# EAGLE design pnc3000-interface (EAGLE 7.6.0)
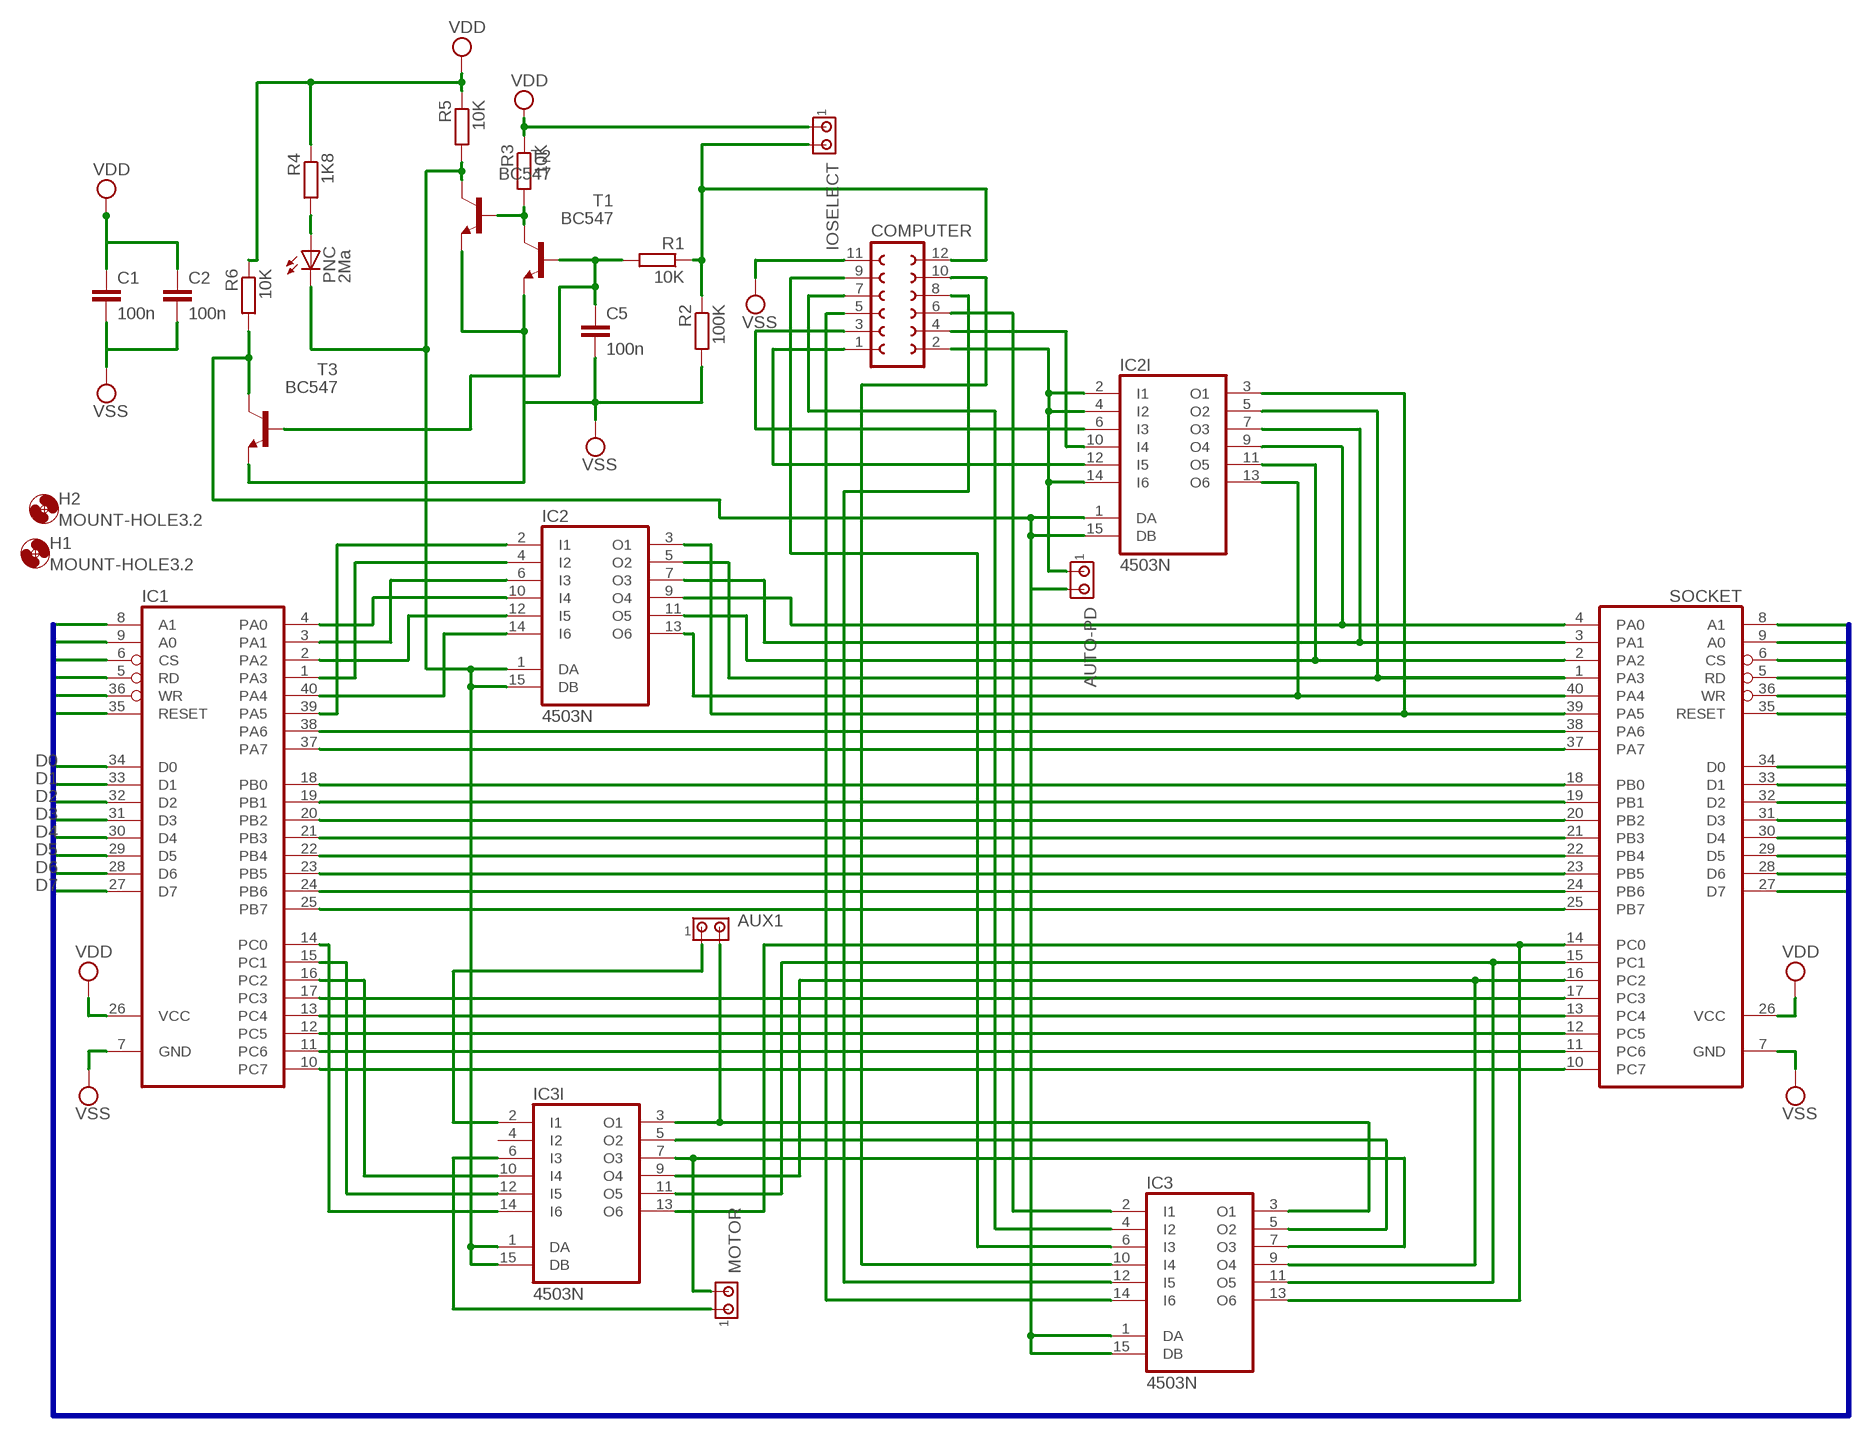
[diagram p0: schematic, sheet 1]

## Parts
AUTO-PD  MTA02-100  [10X02MTA]
AUX1  MTA02-100  [10X02MTA]
C1  100n  C-EU050-024X044  [C050-024X044]
C2  100n  C-EU050-024X044  [C050-024X044]
C5  100n  C-EU050-024X044  [C050-024X044]
COMPUTER  FE06-2W  [FE06-2W]
H1  MOUNT-HOLE3.2  [3,2]
H2  MOUNT-HOLE3.2  [3,2]
IC1  82C55A  [DIL40]
IC2  4503N  [DIL16]
IC2I  4503N  [DIL16]
IC3  4503N  [DIL16]
IC3I  4503N  [DIL16]
IOSELECT  MTA02-100  [10X02MTA]
MOTOR  MTA02-100  [10X02MTA]
PNC  2Ma  LED5MM  [LED5MM]
R1  10K  R-EU_0207/10  [0207/10]
R2  100K  R-EU_0207/10  [0207/10]
R3  10K  R-EU_0207/10  [0207/10]
R4  1K8  R-EU_0207/10  [0207/10]
R5  10K  R-EU_0207/10  [0207/10]
R6  10K  R-EU_0207/10  [0207/10]
SOCKET  82C55A  [DIL40]
T1  BC547  [TO92]
T2  BC547  [TO92]
T3  BC547  [TO92]

## Nets
A0: IC1.9(A0) SOCKET.9(A0)
A1: IC1.8(A1) SOCKET.8(A1)
CS: IC1.6(CS) SOCKET.6(CS)
D0: IC1.34(D0) SOCKET.34(D0)
D1: IC1.33(D1) SOCKET.33(D1)
D2: IC1.32(D2) SOCKET.32(D2)
D3: IC1.31(D3) SOCKET.31(D3)
D4: IC1.30(D4) SOCKET.30(D4)
D5: IC1.29(D5) SOCKET.29(D5)
D6: IC1.28(D6) SOCKET.28(D6)
D7: IC1.27(D7) SOCKET.27(D7)
EXT-ENABLE: AUTO-PD.2 IC2I.1(DA) IC2I.15(DB) IC3.1(DA) IC3.15(DB) R6.2 T3.3(C)
MOTOR: IC3I.6(I3) MOTOR.1
N$1: IC1.18(PB0) SOCKET.18(PB0)
N$2: IC1.19(PB1) SOCKET.19(PB1)
N$3: IC1.20(PB2) SOCKET.20(PB2)
N$4: IC1.21(PB3) SOCKET.21(PB3)
N$5: IC1.22(PB4) SOCKET.22(PB4)
N$6: IC1.23(PB5) SOCKET.23(PB5)
N$7: IC1.24(PB6) SOCKET.24(PB6)
N$8: IC1.25(PB7) SOCKET.25(PB7)
N$9: IC1.11(PC6) SOCKET.11(PC6)
N$10: IC1.10(PC7) SOCKET.10(PC7)
N$11: IC1.37(PA7) SOCKET.37(PA7)
N$12: IC1.17(PC3) SOCKET.17(PC3)
N$13: IC1.13(PC4) SOCKET.13(PC4)
N$14: IC1.12(PC5) SOCKET.12(PC5)
N$15: IC1.38(PA6) SOCKET.38(PA6)
N$16: IC1.4(PA0) IC2.10(I4)
N$17: IC2.9(O4) IC2I.9(O4) SOCKET.4(PA0)
N$18: IC1.3(PA1) IC2.6(I3)
N$19: IC2.7(O3) IC2I.7(O3) SOCKET.3(PA1)
N$20: IC1.2(PA2) IC2.12(I5)
N$21: IC2.11(O5) IC2I.11(O5) SOCKET.2(PA2)
N$22: IC1.1(PA3) IC2.4(I2)
N$23: IC2.5(O2) IC2I.5(O2) SOCKET.1(PA3)
N$24: IC1.39(PA5) IC2.2(I1)
N$25: IC2.3(O1) IC2I.3(O1) SOCKET.39(PA5)
N$26: IC1.40(PA4) IC2.14(I6)
N$27: IC2.13(O6) IC2I.13(O6) SOCKET.40(PA4)
N$28: IC1.16(PC2) IC3I.10(I4)
N$29: IC3.9(O4) IC3I.9(O4) SOCKET.16(PC2)
N$30: IC1.15(PC1) IC3I.12(I5)
N$31: IC3.11(O5) IC3I.11(O5) SOCKET.15(PC1)
N$32: IC1.14(PC0) IC3I.14(I6)
N$33: IC3.13(O6) IC3I.13(O6) SOCKET.14(PC0)
N$34: COMPUTER.6 IC3.2(I1)
N$35: COMPUTER.5 IC3.14(I6)
N$36: COMPUTER.7 IC3.4(I2)
N$37: COMPUTER.1 IC2I.12(I5)
N$38: COMPUTER.3 IC2I.6(I3)
N$39: COMPUTER.4 IC2I.10(I4)
N$40: AUTO-PD.1 COMPUTER.2 IC2I.2(I1) IC2I.4(I2) IC2I.14(I6)
N$41: COMPUTER.8 IC3.12(I5)
N$42: COMPUTER.9 IC3.6(I3)
N$43: COMPUTER.10 IC3.10(I4)
N$44: IC3.7(O3) IC3I.7(O3) MOTOR.2
N$45: IC3.5(O2) IC3I.5(O2)
N$46: AUX1.2 IC3.3(O1) IC3I.3(O1)
N$47: PNC.A R4.2
N$48: COMPUTER.12 IOSELECT.2 R1.1 R2.1
N$49: C5.1 R1.2 T1.2(B) T3.2(B)
N$51: AUX1.1 IC3I.2(I1)
N$55: R3.2 T1.3(C) T2.2(B)
PNC-ENABLE: IC2.1(DA) IC2.15(DB) IC3I.1(DA) IC3I.15(DB) PNC.K(C) R5.2 T2.3(C)
RD: IC1.5(RD) SOCKET.5(RD)
RESET: IC1.35(RESET) SOCKET.35(RESET)
VDD: C1.1 C2.1 IC1.26(VCC) IOSELECT.1 R3.1 R4.1 R5.1 R6.1 SOCKET.26(VCC)
VSS: C1.2 C2.2 C5.2 COMPUTER.11 IC1.7(GND) R2.2 SOCKET.7(GND) T1.1(E) T2.1(E) T3.1(E)
WR: IC1.36(WR) SOCKET.36(WR)
Unconnected: IC3I.4(I2)

## Buses
B$1

## Power pins joined to a net without a drawn wire
VDD: IC2.16(VDD) IC2I.16(VDD) IC3.16(VDD) IC3I.16(VDD)
VSS: IC2.8(VSS) IC2I.8(VSS) IC3.8(VSS) IC3I.8(VSS)

## Library data of the parts
AUTO-PD AUX1 IOSELECT MOTOR = con-amp:MTA02-100: AMP connector
C1 C2 C5 = rcl:C-EU: CAPACITOR, European symbol
COMPUTER = con-lsta:FE06-2W: FEMALE HEADER; OC_FARNELL: unknown; OC_NEWARK: unknown
H1 H2 = holes:MOUNT-HOLE: MOUNTING HOLE with drill center marker
IC1 SOCKET = micro-intel:82C55A: MICROCOMPUTER/PERIPHERAL DEVICE; MF: INTERSIL; MPN: IP82C55AZ; OC_FARNELL: 1562050; OC_NEWARK: 79K6939
IC2 IC2I IC3 IC3I = 45xx:4503: Tri-state hex BUFFER, 74C367, 80C97
PNC = led:LED: LED OSRAM: - CHIPLED LG R971, LG N971, LY N971, LG Q971, LY Q971, LO R971, LY R971 LH N974, LH R974 LS Q976, LO Q976, LY Q976 LO Q996 - Hyper CHIPLED LW Q18S LB Q993, LB Q99A, LB R99A - SideLED LS A670, LO A670, LY A670, LG A670, LP A670 LB A673, LV A673, LT A673, LW A673 LH A674 LY A675 LS A676, LA A676, LO A676, LY A676, LW A676 LS A679, LY A679, LG A679 - Hyper Micro SIDELED® LS Y876, LA Y876, LO Y876, LY Y876 LT Y87S - SmartLED LW L88C, LW L88S LB L89C, LB L89S, LG L890 LS L89K, LO L89K, LY L89K LS L896, LA L896, LO L896, LY L896 - TOPLED LS T670, LO T670, LY T670, LG T670, LP T670 LSG T670, LSP T670, LSY T670, LOP T670, LYG T670 LG T671, LOG T671, LSG T671 LB T673, LV T673, LT T673, LW T673 LH T674 LS T676, LA T676, LO T676, LY T676, LB T676, LH T676, LSB T676, LW T676 LB T67C, LV T67C, LT T67C, LS T67K, LO T67K, LY T67K, LW E67C LS E67B, LA E67B, LO E67B, LY E67B, LB E67C, LV E67C, LT E67C LW T67C LS T679, LY T679, LG T679 LS T770, LO T770, LY T770, LG T770, LP T770 LB T773, LV T773, LT T773, LW T773 LH T774 LS E675, LA E675, LY E675, LS T675 LS T776, LA T776, LO T776, LY T776, LB T776 LHGB T686 LT T68C, LB T68C - Hyper Mini TOPLED® LB M676 - Mini TOPLED Santana® LG M470 LS M47K, LO M47K, LY M47K Source: http://www.osram.convergy.de LUXEON: - LUMILED® LXK2-PW12-R00, LXK2-PW12-S00, LXK2-PW14-U00, LXK2-PW14-V00 LXK2-PM12-R00, LXK2-PM12-S00, LXK2-PM14-U00 LXK2-PE12-Q00, LXK2-PE12-R00, LXK2-PE12-S00, LXK2-PE14-T00, LXK2-PE14-U00 LXK2-PB12-K00, LXK2-PB12-L00, LXK2-PB12-M00, LXK2-PB14-N00, LXK2-PB14-P00, LXK2-PB14-Q00 LXK2-PR12-L00, LXK2-PR12-M00, LXK2-PR14-Q00, LXK2-PR14-R00 LXK2-PD12-Q00, LXK2-PD12-R00, LXK2-PD12-S00 LXK2-PH12-R00, LXK2-PH12-S00 LXK2-PL12-P00, LXK2-PL12-Q00, LXK2-PL12-R00 Source: www.luxeon.com KINGBRIGHT: KA-3528ASYC Source: www.kingbright.com
R1-R6 = rcl:R-EU_: RESISTOR, European symbol
T1-T3 = transistor:BC547: NPN TRANSISTOR

## Board
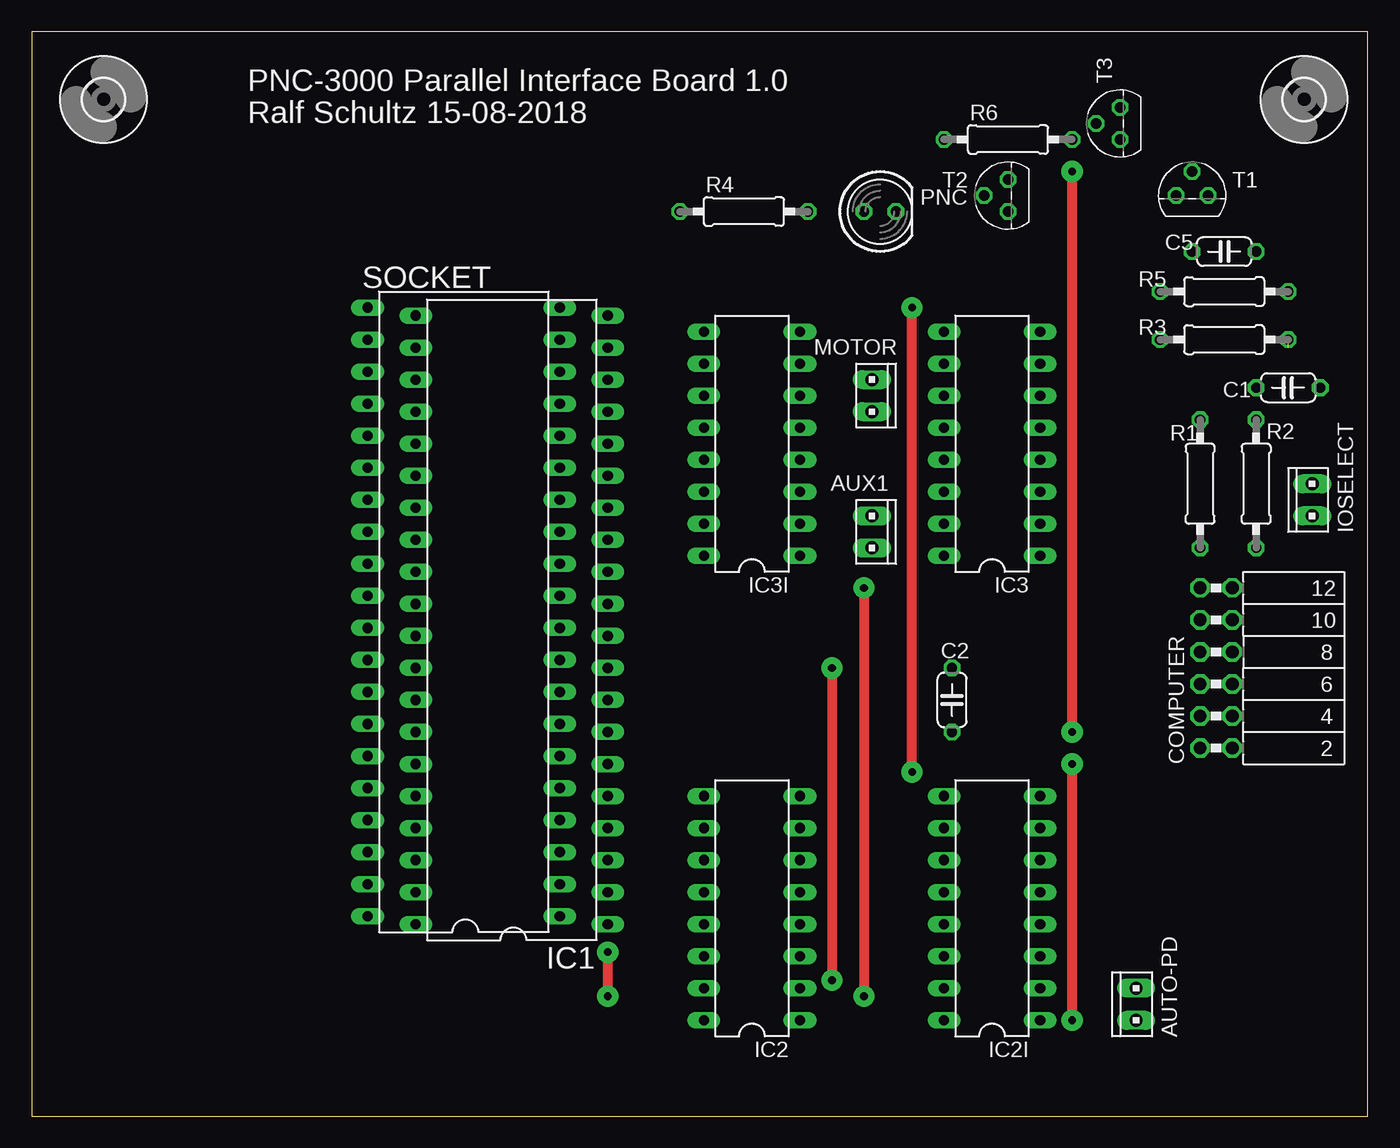
[diagram p1: board, top side]
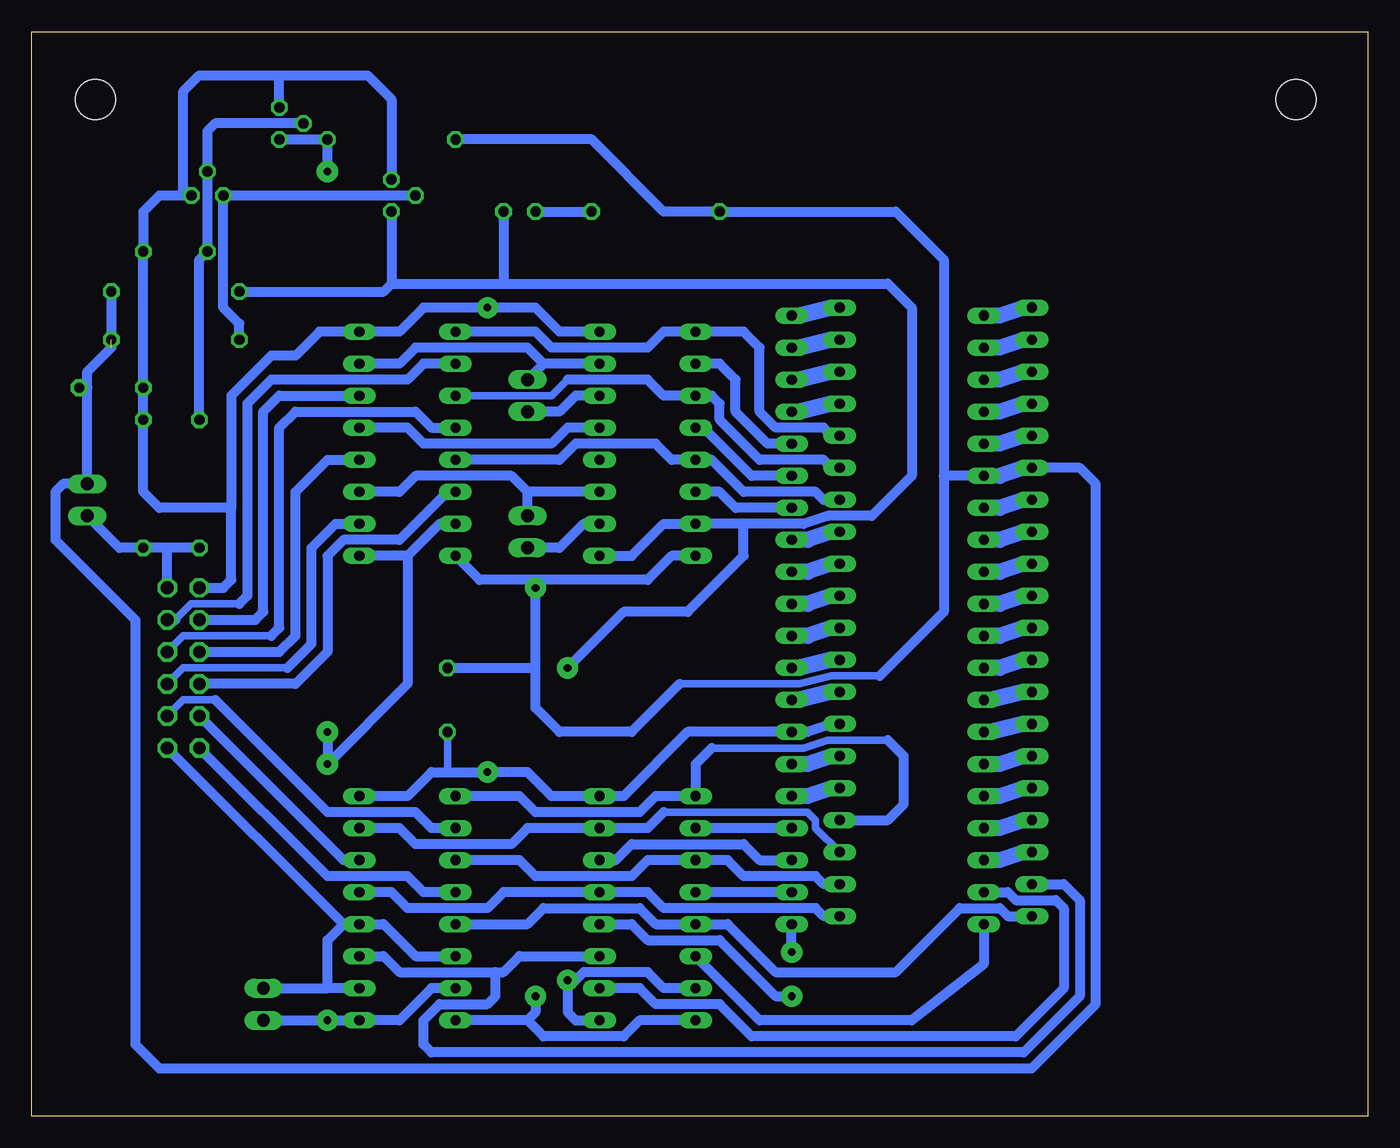
[diagram p2: board, bottom side, seen from below]

Size 106.03 x 86.03 mm. Coordinates in mm from the lower left corner, seen from the top.
Outline: 0,0 106.03,0 106.03,86.03 0,86.03 0,0
Copper layers (1*16): Top 0.035mm / dielectric 1.5mm / Bottom 0.035mm
Design rules "default": minimum track width 10mil, minimum drill 0.6mm, track to track 8mil, track to pad 8mil, pad to pad 8mil, via to via 8mil, smd to smd 8mil, copper to edge 40mil, drill to drill 8mil, minimum pad ring 10mil, minimum via ring 8mil, stop-mask expansion 4mil, vias tented up to drill 0mil, thermal gap 10mil

### Footprints (pad centres in the part's own frame; a part is rotated, then mirrored left to right if it is on the bottom)
10X02MTA = drill 1.016 long: 1 1.27,0; 2 -1.27,0
C050-024X044 = drill 0.813 octagon: 1 -2.54,0; 2 2.54,0
FE06-2W = drill 1.016 octagon: 1 -6.35,1.27; 2 -6.35,-1.27; 3 -3.81,1.27; 4 -3.81,-1.27; 5 -1.27,1.27; 6 -1.27,-1.27; 7 1.27,1.27; 8 1.27,-1.27; 9 3.81,1.27; 10 3.81,-1.27; 11 6.35,1.27; 12 6.35,-1.27
3,2 = hole 3.2: 0,0
DIL40 = drill 0.813 long: 1 -24.13,-7.62; 2 -21.59,-7.62; 3 -19.05,-7.62; 4 -16.51,-7.62; 5 -13.97,-7.62; 6 -11.43,-7.62; 7 -8.89,-7.62; 8 -6.35,-7.62; 9 -3.81,-7.62; 10 -1.27,-7.62; 11 1.27,-7.62; 12 3.81,-7.62; 13 6.35,-7.62; 14 8.89,-7.62; 15 11.43,-7.62; 16 13.97,-7.62; 17 16.51,-7.62; 18 19.05,-7.62; 19 21.59,-7.62; 20 24.13,-7.62; 21 24.13,7.62; 22 21.59,7.62; 23 19.05,7.62; 24 16.51,7.62; 25 13.97,7.62; 26 11.43,7.62; 27 8.89,7.62; 28 6.35,7.62; 29 3.81,7.62; 30 1.27,7.62; 31 -1.27,7.62; 32 -3.81,7.62; 33 -6.35,7.62; 34 -8.89,7.62; 35 -11.43,7.62; 36 -13.97,7.62; 37 -16.51,7.62; 38 -19.05,7.62; 39 -21.59,7.62; 40 -24.13,7.62
DIL16 = drill 0.813 long: 1 -8.89,-3.81; 2 -6.35,-3.81; 3 -3.81,-3.81; 4 -1.27,-3.81; 5 1.27,-3.81; 6 3.81,-3.81; 7 6.35,-3.81; 8 8.89,-3.81; 9 8.89,3.81; 10 6.35,3.81; 11 3.81,3.81; 12 1.27,3.81; 13 -1.27,3.81; 14 -3.81,3.81; 15 -6.35,3.81; 16 -8.89,3.81
LED5MM = drill 0.813 octagon: A -1.27,0; K 1.27,0
0207/10 = drill 0.813 octagon: 1 -5.08,0; 2 5.08,0
TO92 = drill 0.813 octagon: 1 1.27,0; 2 0,1.905; 3 -1.27,0

### Placement (x,y rotation side)
AUTO-PD  87.63,8.89 90 top
AUX1  66.67,46.35 270 top
C1  99.69,57.78 180 top
C2  73.03,33.02 270 top
C5  94.61,68.58 0 top
COMPUTER  93.98,35.56 90 top
H1  100.97,80.64 0 top
H2  5.71,80.64 0 top
IC1  38.1,39.37 90 top
IC2  57.15,16.51 90 top
IC2I  76.2,16.51 90 top
IC3  76.2,53.34 90 top
IC3I  57.15,53.34 90 top
IOSELECT  101.6,48.9 90 top
MOTOR  66.67,57.15 270 top
PNC  67.31,71.75 0 top
R1  92.71,50.16 90 top
R2  97.16,50.16 90 top
R3  94.61,61.59 180 top
R4  56.52,71.75 0 top
R5  94.61,65.41 180 top
R6  77.47,77.47 0 top
SOCKET  34.29,40.01 90 top
T1  92.08,73.03 0 top
T2  77.47,73.03 90 top
T3  86.36,78.74 90 top

### Tracks (layer width: path | path; a pad name or v marks a point on that pad's centre or on a via)
A0
  Bottom 1.27: SOCKET.9 42.55,36.2 45.09,35.56 IC1.9
A1
  Bottom 1.27: SOCKET.8 42.55,33.66 45.09,33.02 IC1.8
CS
  Bottom 1.27: SOCKET.6 42.55,28.57 44.45,27.94 IC1.6
D0
  Bottom 1.27: SOCKET.34 27.3,31.11 29.84,30.48 IC1.34
D1
  Bottom 1.27: SOCKET.33 27.3,33.66 29.84,33.02 IC1.33
D2
  Bottom 1.27: SOCKET.32 27.3,36.2 29.21,35.56 IC1.32
D3
  Bottom 1.27: SOCKET.31 27.3,38.73 29.21,38.1 IC1.31
D4
  Bottom 1.27: SOCKET.30 27.3,41.27 29.21,40.64 IC1.30
D5
  Bottom 1.27: SOCKET.29 27.3,43.81 29.21,43.18 IC1.29
D6
  Bottom 1.27: SOCKET.28 27.3,46.35 29.21,45.72 IC1.28
D7
  Bottom 1.27: SOCKET.27 27.3,48.9 29.21,48.26 IC1.27
EXT-ENABLE  (via drill 0.6, 0.6 pad 1.68)
  Top 0.813: v82.55,27.94 v82.55,7.62 | v82.55,74.93 v82.55,30.48
  Bottom 0.813: IC2I.15 74.3,10.16 76.83,7.62 IC2I.1 v82.55,7.62 AUTO-PD.2 | IC3.15 73.66,46.99 76.2,44.45 | 76.2,44.45 IC3.1 | 76.2,44.45 76.2,34.29 v82.55,27.94 v82.55,30.48 | v82.55,74.93 R6.2 T3.3
MOTOR
  Bottom 0.813: IC3I.6 62.87,57.15 64.14,55.88 MOTOR.1
N$1
  Bottom 1.27: SOCKET.18 42.55,59.05 45.09,58.42 IC1.18
N$2
  Bottom 1.27: SOCKET.19 42.55,61.59 45.09,60.96 IC1.19
N$3
  Bottom 1.27: SOCKET.20 42.55,64.14 45.09,63.5 IC1.20
N$4
  Bottom 1.27: SOCKET.21 27.3,64.14 29.21,63.5 IC1.21
N$5
  Bottom 1.27: SOCKET.22 27.3,61.59 29.21,60.96 IC1.22
N$6
  Bottom 1.27: SOCKET.23 27.3,59.05 29.21,58.42 IC1.23
N$7
  Bottom 1.27: SOCKET.24 27.3,56.52 29.21,55.88 IC1.24
N$8
  Bottom 1.27: SOCKET.25 27.3,53.98 29.21,53.34 IC1.25
N$9
  Bottom 1.27: SOCKET.11 42.55,41.27 44.45,40.64 IC1.11
N$10
  Bottom 1.27: SOCKET.10 42.55,38.73 44.45,38.1 IC1.10
N$11
  Bottom 1.27: SOCKET.37 27.3,23.5 29.21,22.86 IC1.37
N$12
  Bottom 1.27: SOCKET.17 42.55,56.52 45.09,55.88 IC1.17
N$13
  Bottom 1.27: SOCKET.13 42.55,46.35 44.45,45.72 IC1.13
N$14
  Bottom 1.27: SOCKET.12 42.55,43.81 44.45,43.18 IC1.12
N$15
  Bottom 1.27: SOCKET.38 27.3,20.95 29.21,20.32 IC1.38
N$16
  Bottom 0.813: IC1.4 IC2.10
N$17
  Bottom 0.61: 38.1,29.84 42.86,29.84 44.77,29.21 52.07,29.21
  Bottom 0.813: IC2I.9 67.31,25.4 66.04,24.13 57.78,24.13 56.52,25.4 IC2.9 53.34,27.94 52.07,29.21 | SOCKET.4 38.1,23.5 36.83,24.77 36.83,28.57 38.1,29.84
N$18
  Bottom 0.813: IC2.6 59.69,20.32 58.42,21.59 49.53,21.59 48.26,20.32 IC1.3
N$19
  Bottom 0.61: SOCKET.3 43.81,22.86 43.81,23.5 44.45,24.13 55.88,24.13
  Bottom 0.813: IC2I.7 76.83,22.86 75.56,21.59 67.94,21.59 66.67,22.86 IC2.7 57.15,22.86 55.88,24.13
N$20
  Bottom 0.813: IC1.2 IC2.12
N$21
  Bottom 0.813: SOCKET.2 43.18,18.41 43.81,19.05 49.53,19.05 50.8,20.32 IC2.11 57.15,20.32 58.42,19.05 66.04,19.05 67.31,20.32 IC2I.11
N$22  (via drill 0.6, 0.6 pad 1.68)
  Top 0.813: v45.72,9.53 v45.72,13.02
  Bottom 0.813: IC2.4 58.42,15.24 57.15,13.97 51.44,13.97 46.99,9.53 v45.72,9.53 | v45.72,13.02 IC1.1
N$23
  Bottom 0.813: SOCKET.1 43.18,15.88 43.81,16.51 55.88,16.51 57.15,17.78 IC2.5 68.58,17.78 69.85,16.51 76.2,16.51 77.47,17.78 IC2I.5
N$24
  Bottom 0.813: IC1.39 28.57,17.78 27.94,17.14 24.77,17.14 24.13,16.51 24.13,10.16 27.94,6.35 48.9,6.35 51.44,8.89 56.52,8.89 57.78,10.16 IC2.2
N$25
  Bottom 0.813: IC2I.3 78.11,12.7 76.83,11.43 69.22,11.43 | 69.22,11.43 68.58,11.43 67.31,12.7 IC2.3 | SOCKET.39 24.13,18.41 22.86,17.14 22.86,9.53 27.3,5.08 74.3,5.08 74.93,5.71 74.93,7.62 73.66,8.89 69.85,8.89 69.22,9.53 69.22,11.43
N$26
  Bottom 0.813: IC1.40 30.48,12.06 36.2,7.62 48.26,7.62 IC2.14
N$27
  Bottom 0.813: IC2I.13 66.67,15.24 65.41,16.51 57.78,16.51 56.52,15.24 IC2.13 50.8,15.24 46.99,11.43 37.47,11.43 32.38,16.51 29.21,16.51 28.57,15.88 SOCKET.40
N$28
  Bottom 0.813: IC1.16 47.62,53.34 50.16,55.88 50.16,58.42 51.44,59.69 IC3I.10
N$29
  Bottom 0.813: SOCKET.16 42.55,53.98 43.18,54.61 46.99,54.61 48.26,55.88 48.26,60.96 49.53,62.23 IC3I.9 55.88,62.23 57.15,60.96 64.77,60.96 66.04,62.23 IC3.9
N$30
  Bottom 0.813: IC1.15 48.9,50.8 52.7,54.61 IC3I.12
N$31
  Bottom 0.61: 63.5,58.42 64.77,57.15 IC3.11
  Bottom 0.813: SOCKET.15 42.55,51.44 43.18,52.07 48.26,52.07 51.44,55.24 51.44,56.52 52.07,57.15 IC3I.11 55.88,57.15 57.15,58.42 63.5,58.42
N$32
  Bottom 0.813: IC1.14 50.16,48.26 51.44,49.53 IC3I.14
N$33
  Bottom 0.813: SOCKET.14 43.18,48.9 43.81,49.53 49.53,49.53 52.07,52.07 IC3I.13 55.24,52.07 56.52,53.34 62.87,53.34 64.14,52.07 IC3.13
N$34
  Bottom 0.61: COMPUTER.6 93.98,35.56 85.72,35.56
  Bottom 0.813: 85.72,35.56 83.82,37.47 83.82,45.09 81.92,46.99 IC3.2
N$35
  Bottom 0.813: IC3.14 73.03,49.53 76.83,45.72 81.28,45.72 82.55,44.45 82.55,36.83 85.09,34.29 COMPUTER.5
N$36
  Bottom 0.813: COMPUTER.7 86.36,36.83 85.09,38.1 85.09,49.53 82.55,52.07 IC3.4
N$37
  Bottom 0.813: IC2I.12 74.93,17.78 76.2,19.05 82.55,19.05 COMPUTER.1
N$38
  Bottom 0.813: IC2I.6 81.28,20.32 COMPUTER.3
N$39
  Bottom 0.61: 91.44,33.02 93.98,33.02 COMPUTER.4
  Bottom 0.813: IC2I.10 74.3,22.86 75.56,24.13 82.55,24.13 91.44,33.02
N$40
  Bottom 0.813: 81.28,15.24 IC2I.4 78.11,15.24 75.56,12.7 IC2I.14 | 81.28,15.24 COMPUTER.2 | IC2I.2 82.55,10.16 | 82.55,10.16 82.55,13.97 81.28,15.24 | AUTO-PD.1 82.55,10.16
N$41
  Bottom 0.61: COMPUTER.8 93.98,38.1 87,38.1
  Bottom 0.813: 87,38.1 86.36,38.73 86.36,54.61 85.09,55.88 75.56,55.88 74.3,54.61 IC3.12
N$42
  Bottom 0.813: COMPUTER.9 88.27,39.37 87.63,40.01 87.63,55.88 86.36,57.15 IC3.6
N$43
  Bottom 0.61: 89.53,40.64 93.34,40.64 94.61,39.37
  Bottom 0.813: IC3.10 74.93,59.69 76.2,58.42 87,58.42 88.9,56.52 88.9,41.27 89.53,40.64 | 94.61,39.37 COMPUTER.10
N$44
  Bottom 0.813: IC3I.7 65.41,59.69 | 65.41,59.69 66.67,60.96 75.56,60.96 76.83,59.69 IC3.7 | MOTOR.2 65.41,59.69
N$45
  Bottom 0.813: IC3I.5 63.5,54.61 64.77,53.34 74.93,53.34 76.2,54.61 IC3.5
N$46
  Bottom 0.813: IC3I.3 66.67,49.53 | 66.67,49.53 67.94,50.8 75.56,50.8 76.83,49.53 IC3.3 | AUX1.2 66.67,49.53
N$47
  Bottom 0.813: PNC.A R4.2
N$48
  Bottom 0.813: R1.1 95.25,45.09 | 95.25,45.09 R2.1 99.06,45.09 IOSELECT.2 | COMPUTER.12 95.25,45.09
N$49
  Bottom 0.813: R1.2 92.71,67.94 C5.1 T1.2 92.08,78.11 91.44,78.74 T3.2
N$51
  Bottom 0.813: IC3I.2 62.23,46.99 64.14,45.09 AUX1.1
N$55
  Bottom 0.813: R3.2 89.53,62.87 90.81,64.14 T1.3 T2.2
PNC-ENABLE  (via drill 0.6, 0.6 pad 1.68)
  Top 0.813: v63.5,35.56 v63.5,10.79
  Bottom 0.813: IC2.15 55.88,10.16 57.15,11.43 62.23,11.43 63.5,10.16 | 63.5,10.16 63.5,8.26 62.87,7.62 IC2.1 | T2.3 77.47,66.04 | R5.2 78.11,65.41 77.47,66.04 | 77.47,66.04 68.58,66.04 | 68.58,66.04 38.1,66.04 36.2,64.14 36.2,50.8 39.37,47.62 42.86,47.62 44.77,46.99 49.53,46.99 | IC3I.1 58.42,44.45 55.88,46.99 IC3I.15 49.53,46.99 | v63.5,35.56 59.05,40.01 53.98,40.01 49.53,44.45 49.53,46.99 | v63.5,10.79 63.5,10.16 | PNC.K 68.58,66.04
RD
  Bottom 1.27: SOCKET.5 42.55,26.04 44.45,25.4 IC1.5
RESET
  Bottom 1.27: SOCKET.35 27.3,28.57 29.21,27.94 IC1.35
VDD  (via drill 0.6, 0.6 pad 1.68)  (1 unrouted)
  Top 0.813: v66.04,41.91 v66.04,9.53
  Bottom 0.61: 38.73,34.92 42.55,34.92 45.09,34.29 54.61,34.29
  Bottom 0.813: IC3I.16 55.24,44.45 57.15,42.55 66.04,42.55 | 66.04,42.55 70.48,42.55 IC3.16 | IC2.16 57.78,7.62 59.05,6.35 65.41,6.35 66.67,7.62 | 66.67,7.62 IC2I.16 | 66.04,42.55 v66.04,41.91 66.04,35.56 | v66.04,9.53 66.04,8.26 66.67,7.62 | SOCKET.26 22.86,51.44 21.59,50.16 21.59,8.89 26.67,3.81 95.89,3.81 97.79,5.71 97.79,39.37 104.14,45.72 104.14,49.53 103.5,50.16 IOSELECT.1 101.6,57.78 | R5.1 R3.1 | 101.6,57.78 101.6,59.05 99.69,60.96 | C1.1 101.6,57.78 | 33.66,50.8 IC1.26 29.21,50.8 | 33.66,50.8 33.66,40.01 38.73,34.92 | 54.61,34.29 58.42,30.48 64.14,30.48 66.04,32.38 66.04,35.56 | C2.1 66.04,35.56 | 33.66,50.8 33.66,67.94 37.47,71.75 R4.1 55.88,71.75 61.59,77.47 R6.1
  Bottom 1.27: SOCKET.26 27.3,51.44 29.21,50.8
VSS  (via drill 0.6, 0.6 pad 1.68)
  Top 0.813: v69.85,27.3 v69.85,64.14
  Bottom 0.61: C2.2 73.03,27.3
  Bottom 0.813: IC3I.8 64.14,62.23 66.04,64.14 v69.85,64.14 74.93,64.14 76.83,62.23 IC3.8 83.19,62.23 85.09,60.33 87,60.33 90.17,57.15 90.17,48.26 | IC2I.8 76.2,25.4 74.3,27.3 73.03,27.3 v69.85,27.3 66.67,27.3 64.77,25.4 IC2.8 59.05,25.4 53.98,30.48 IC1.7 44.45,30.48 42.55,31.11 | 93.98,73.03 95.89,73.03 97.16,71.75 C5.2 C1.2 R2.2 97.16,49.53 95.89,48.26 90.17,48.26 | T1.1 93.98,73.03 | 93.98,73.03 93.98,81.28 92.71,82.55 86.36,82.55 | 86.36,82.55 79.38,82.55 77.47,80.64 T2.1 | COMPUTER.11 90.81,41.91 90.17,42.55 90.17,48.26 | T3.1 86.36,82.55
  Bottom 1.27: SOCKET.7 42.55,31.11
WR
  Bottom 1.27: SOCKET.36 27.3,26.04 29.21,25.4 IC1.36

### Text on the board
tPlace: PNC-3000 Parallel Interface Board 1.0 | Ralf Schultz 15-08-2018